# EAGLE design swimate_displayext (EAGLE 6.4)
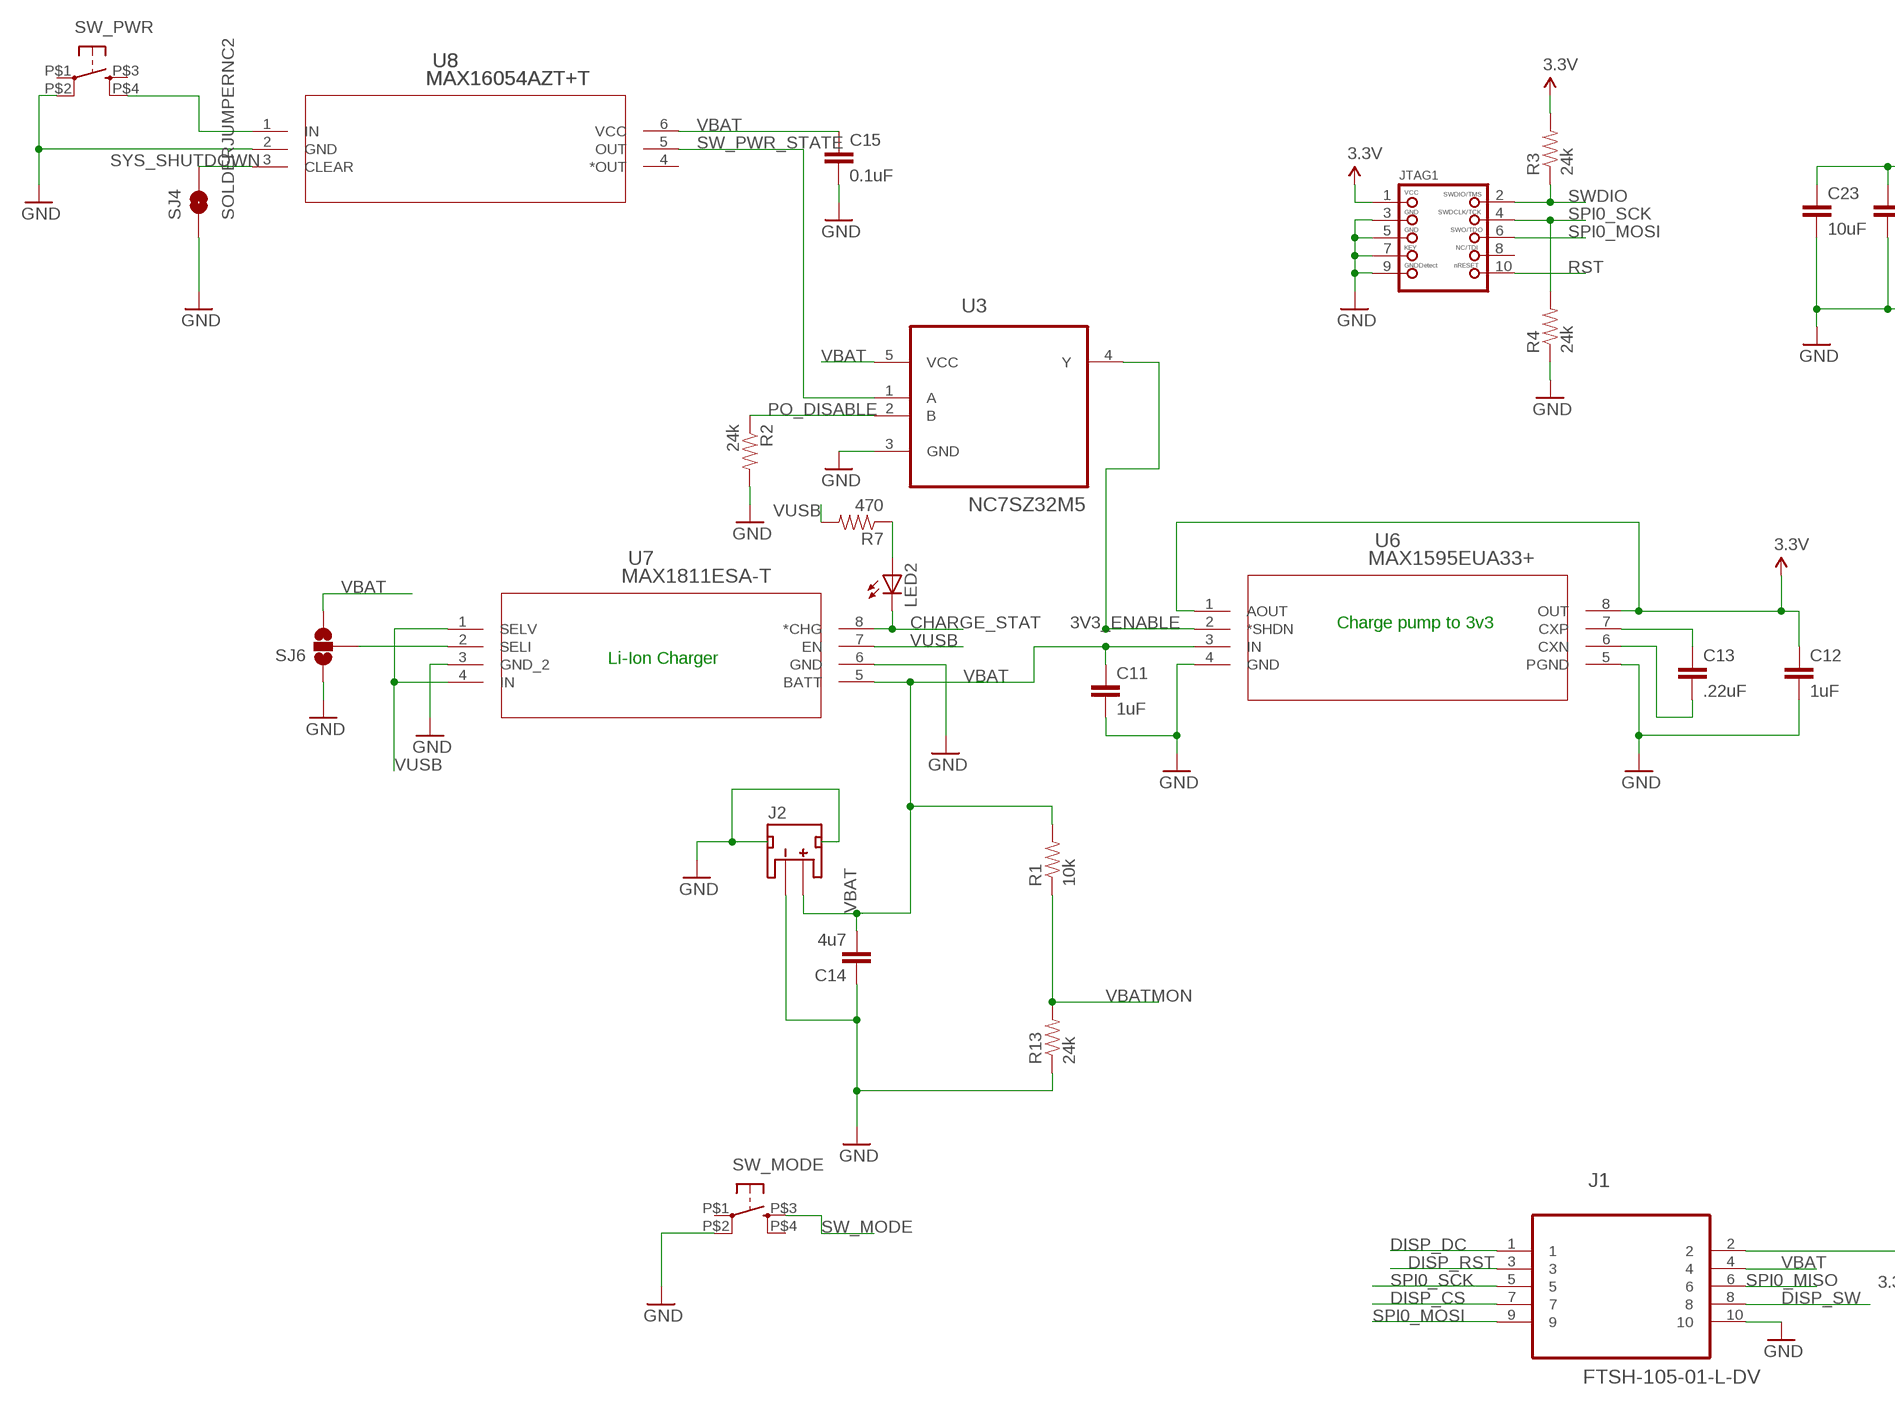
[diagram p0: schematic, sheet 1, part 1 of 2]
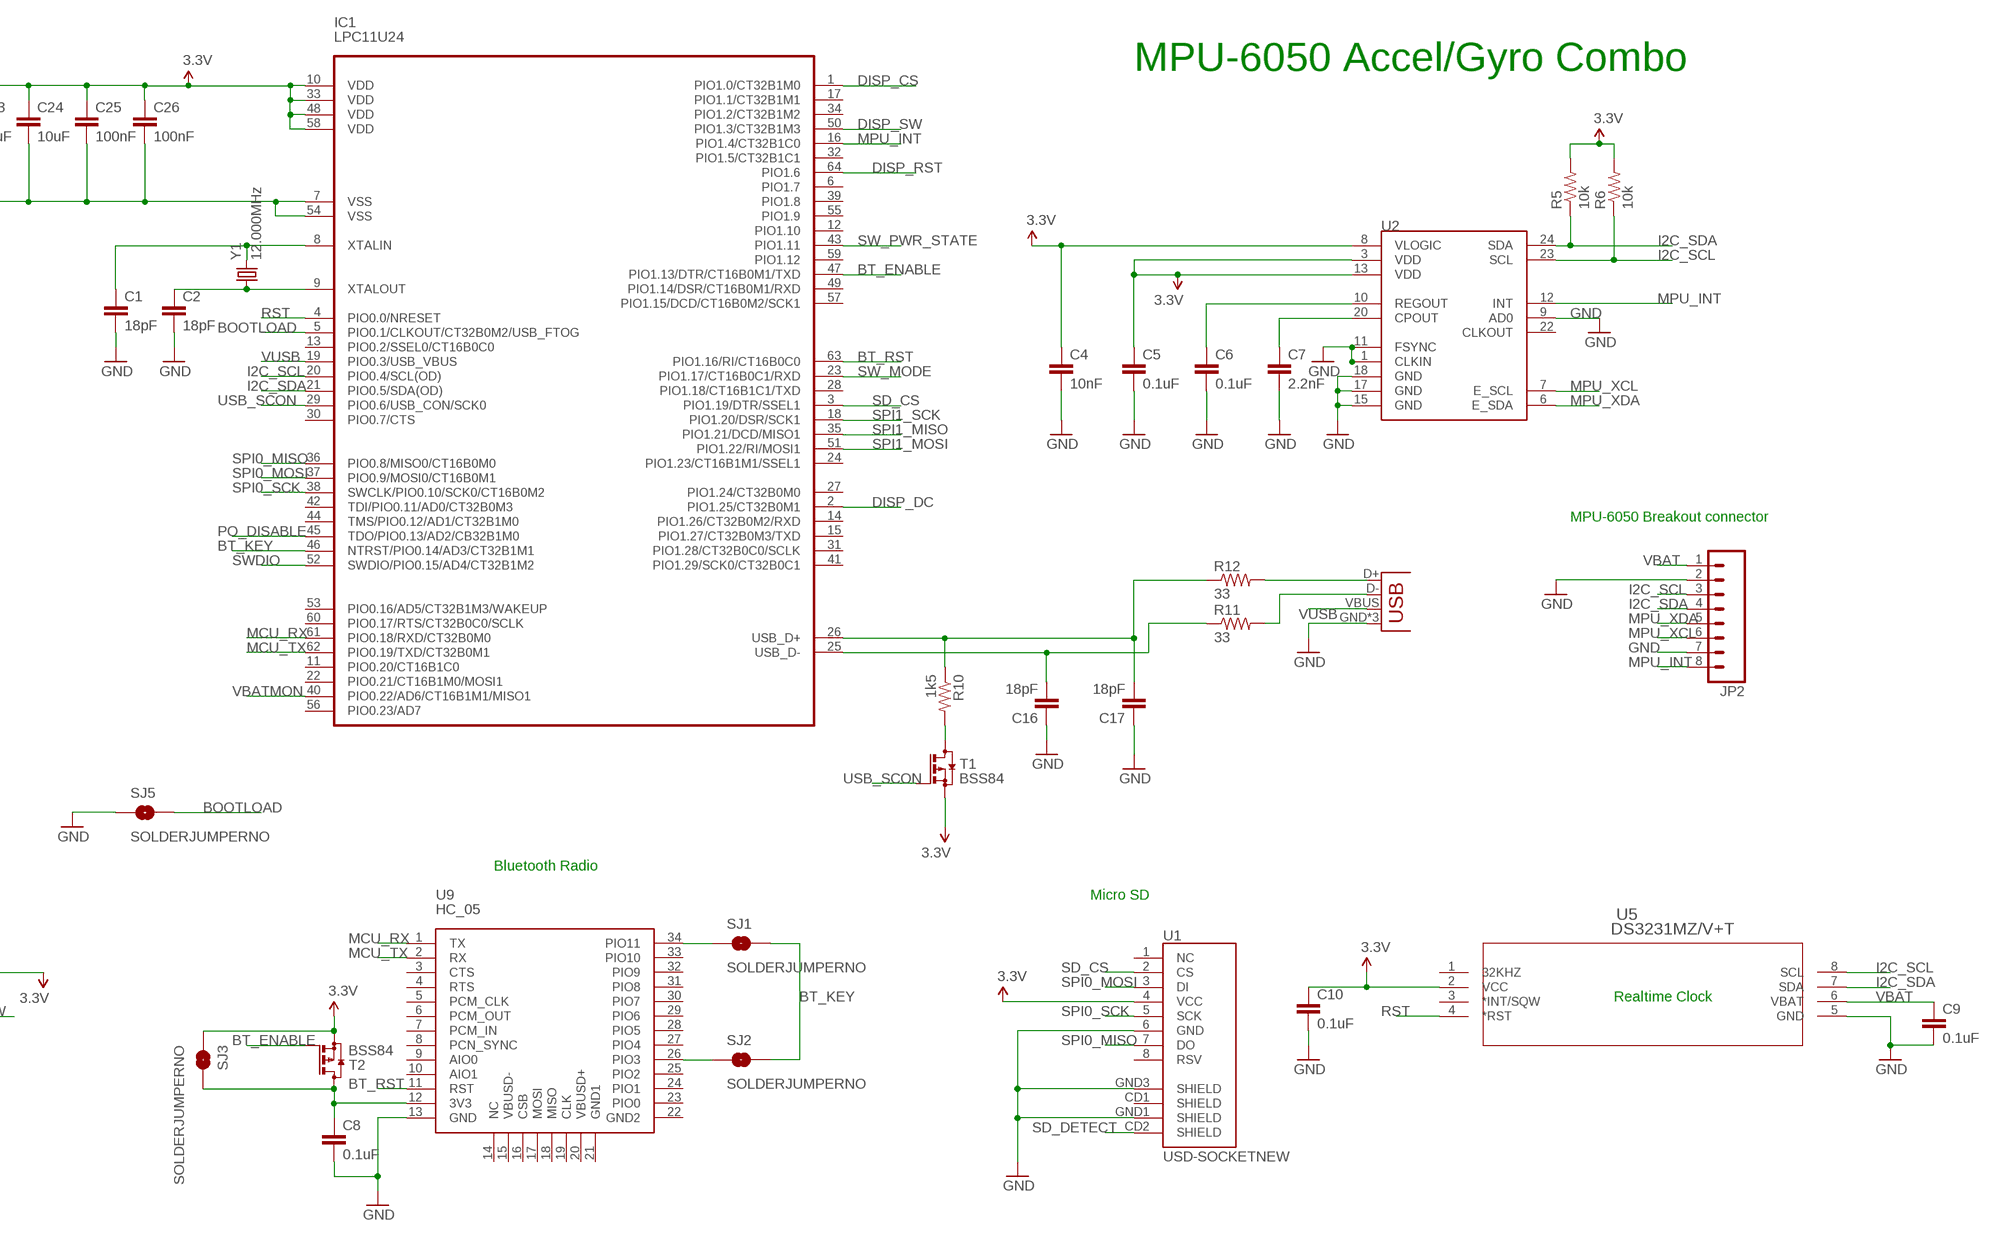
[diagram p1: schematic, sheet 1, part 2 of 2]

## Parts
C1  18pF  CAP0805  [0805]
C2  18pF  CAP0805  [0805]
C4  10nF  CAP0805  [0805]
C5  0.1uF  CAP0805  [0805]
C6  0.1uF  CAP0805  [0805]
C7  2.2nF  CAP0805  [0805]
C8  0.1uF  CAP0805  [0805]
C9  0.1uF  CAP0805  [0805]
C10  0.1uF  CAP0805  [0805]
C11  1uF  CAP1206  [1206]
C12  1uF  CAP1206  [1206]
C13  .22uF  CAP0805  [0805]
C14  4u7  CAP1206  [1206]
C15  0.1uF  CAP0805  [0805]
C16  18pF  CAP0805  [0805]
C17  18pF  CAP0805  [0805]
C23  10uF  CAP0805  [0805]
C24  10uF  CAP0805  [0805]
C25  100nF  CAP0805  [0805]
C26  100nF  CAP0805  [0805]
IC1  LPC11U24  [MBED-ICS_LQFP64]
J1  FTSH-105-01-L-DV  [SAMTEC_FTSH-105-01-L-DV]
J2  JST_2MM_MALE  [JST-2-SMD]
JP2  M08  [1X08_PIN1_NO_SILK]
JP3  USB-MICROB  [USB-MICROB]
JTAG1  JTAG-CORTEXM3  [2X05_1.27MM_SMT]
LED2  LED0603  [LED-0603]
R1  10k  RESISTOR0603-RES  [0603-RES]
R2  24k  RESISTOR0805-RES  [0805]
R3  24k  RESISTOR0805-RES  [0805]
R4  24k  RESISTOR0805-RES  [0805]
R5  10k  RESISTOR0805-RES  [0805]
R6  10k  RESISTOR0805-RES  [0805]
R7  470  RESISTOR0805-RES  [0805]
R10  1k5  RESISTOR0805-RES  [0805]
R11  33  RESISTOR0805-RES  [0805]
R12  33  RESISTOR0805-RES  [0805]
R13  24k  RESISTOR0603-RES  [0603-RES]
SJ1  SOLDERJUMPERNO  [SJ_2S-NO]
SJ2  SOLDERJUMPERNO  [SJ_2S-NO]
SJ3  SOLDERJUMPERNO  [SJ_2S-NO]
SJ4  SOLDERJUMPERNC2  [SJ_2S-NOTRACE]
SJ5  SOLDERJUMPERNO  [SJ_2S-NO]
SJ6  SOLDERJUMPER_2WAYS  [SJ_3]
SW_MODE  TAC_SWITCHKSA_SEALED  [KSA_SEALED_TAC_SWITCH]
SW_PWR  TAC_SWITCHKSA_SEALED  [KSA_SEALED_TAC_SWITCH]
T1  BSS84  [SOT23]
T2  BSS84  [SOT23]
U1  USD-SOCKETNEW  [MICRO-SD-SOCKET-PP]
U2  MPU-9150QFN-24-NP  [QFN-24-NP]
U3  NC7SZ32M5  [SOT95P280X145-5N]
U5  DS3231MZ/V+T  [21-0041B_8]
U6  MAX1595EUA33+  [21-0036K]
U7  MAX1811ESA-T  [21-0041B_8]
U8  MAX16054AZT+T  [21-0114C]
U9  HC_05  [BLUETOOTH_SMD]
Y1  12.000MHz  CRYSTAL10.5X4.8  [CRYSTAL-SMD-10.5X4.8-2PIN]

## Nets
3.3V: C4.1 C5.1 C10.1 C12.1 C23.1 C24.1 C25.1 C26.1 IC1.10(VDD) IC1.33(VDD) IC1.48(VDD) IC1.58(VDD) J1.2 JTAG1.1 R3.2 R5.2 R6.2 SJ3.1 T1.2(S) T2.2(S) U1.4(VCC) U2.3(VDD) U2.8(VLOGIC) U2.13(VDD) U5.2(VCC) U6.1(AOUT) U6.8(OUT)
3V3_ENABLE: U3.4(Y) U6.2(*SHDN)
BOOTLOAD: IC1.5(PIO0.1/CLKOUT/CT32B0M2/USB_FTOG) SJ5.2
BT_ENABLE: IC1.47(PIO1.13/DTR/CT16B0M1/TXD) T2.1(G)
BT_KEY: IC1.46(NTRST/PIO0.14/AD3/CT32B1M1) SJ1.2 SJ2.2
BT_RST: IC1.63(PIO1.16/RI/CT16B0C0) U9.11(RST)
CHARGE_STAT: LED2.C U7.8(*CHG)
DISP_CS: IC1.1(PIO1.0/CT32B1M0) J1.7
DISP_DC: IC1.2(PIO1.25/CT32B0M1) J1.1
DISP_RST: IC1.64(PIO1.6) J1.3
DISP_SW: IC1.50(PIO1.3/CT32B1M3) J1.8
GND: C1.2 C2.2 C4.2 C5.2 C6.2 C7.2 C8.2 C9.2 C10.2 C11.2 C12.2 C14.1 C15.2 C16.1 C17.1 C23.2 C24.2 C25.2 C26.2 IC1.7(VSS) IC1.54(VSS) J1.10 J2.1(-) J2.NC1(PAD1) J2.NC2(PAD2) JP2.2 JP2.7 JP3.GND JP3.MT1(GND) JP3.MT2(GND) JTAG1.3 JTAG1.5 JTAG1.7 JTAG1.9 R2.2 R4.1 R13.1 SJ4.1 SJ5.1 SJ6.1 SW_MODE.P$2 SW_PWR.P$2 U1.6(GND) U1.GND1(SHIELD) U1.GND3(SHIELD) U2.1(CLKIN) U2.9(AD0) U2.11(FSYNC) U2.15(GND) U2.17(GND) U2.18(GND) U3.3(GND) U5.5(GND) U6.4(GND) U6.5(PGND) U7.3(GND_2) U7.6(GND) U8.2(GND) U9.13(GND)
I2C_SCL: IC1.20(PIO0.4/SCL(OD)) JP2.3 R6.1 U2.23(SCL) U5.8(SCL)
I2C_SDA: IC1.21(PIO0.5/SDA(OD)) JP2.4 R5.1 U2.24(SDA) U5.7(SDA)
MCU_RX: IC1.61(PIO0.18/RXD/CT32B0M0) U9.1(TX)
MCU_TX: IC1.62(PIO0.19/TXD/CT32B0M1) U9.2(RX)
MPU_INT: IC1.16(PIO1.4/CT32B1C0) JP2.8 U2.12(INT)
MPU_XCL: JP2.6 U2.7(E_SCL)
MPU_XDA: JP2.5 U2.6(E_SDA)
N$1: SW_PWR.P$4 U8.1(IN)
N$3: SJ6.2 U7.2(SELI)
N$5: C6.1 U2.10(REGOUT)
N$7: C7.1 U2.20(CPOUT)
N$8: LED2.A R7.1
N$9: SJ2.1 U9.26(PIO3)
N$11: SJ1.1 U9.34(PIO11)
N$13: C13.1 U6.7(CXP)
N$14: C13.2 U6.6(CXN)
N$15: C8.1 SJ3.2 T2.3(D) U9.12(3V3)
N$16: R10.2 T1.3(D)
N$19: JP3.D+ R12.2
N$20: JP3.D- R11.2
N$23: C1.1 IC1.8(XTALIN) Y1.P$2
N$24: C2.1 IC1.9(XTALOUT) Y1.P$1
PO_DISABLE: IC1.45(TDO/PIO0.13/AD2/CB32B1M0) R2.1 U3.2(B)
RST: IC1.4(PIO0.0/NRESET) JTAG1.10 U5.4(*RST)
SD_CS: IC1.3(PIO1.19/DTR/SSEL1) U1.2(CS)
SD_DETECT: U1.CD2(SHIELD)
SPI0_MISO: IC1.36(PIO0.8/MISO0/CT16B0M0) J1.6 U1.7(DO)
SPI0_MOSI: IC1.37(PIO0.9/MOSI0/CT16B0M1) J1.9 JTAG1.6 U1.3(DI)
SPI0_SCK: IC1.38(SWCLK/PIO0.10/SCK0/CT16B0M2) J1.5 JTAG1.4 R4.2 U1.5(SCK)
SPI1_MISO: IC1.35(PIO1.21/DCD/MISO1)
SPI1_MOSI: IC1.51(PIO1.22/RI/MOSI1)
SPI1_SCK: IC1.18(PIO1.20/DSR/SCK1)
SW_MODE: IC1.23(PIO1.17/CT16B0C1/RXD) SW_MODE.P$3
SW_PWR_STATE: IC1.43(PIO1.11) U3.1(A) U8.5(OUT)
SWDIO: IC1.52(SWDIO/PIO0.15/AD4/CT32B1M2) JTAG1.2 R3.1
SYS_SHUTDOWN: SJ4.2 U8.3(CLEAR)
USB_SCON: IC1.29(PIO0.6/USB_CON/SCK0) T1.1(G)
USBD_N: C16.2 IC1.25(USB_D-) R11.1
USBD_P: C17.2 IC1.26(USB_D+) R10.1 R12.1
VBAT: C9.1 C11.1 C14.2 C15.1 J1.4 J2.2(+) JP2.1 R1.2 SJ6.3 U3.5(VCC) U5.6(VBAT) U6.3(IN) U7.5(BATT) U8.6(VCC)
VBATMON: IC1.40(PIO0.22/AD6/CT16B1M1/MISO1) R1.1 R13.2
VUSB: IC1.19(PIO0.3/USB_VBUS) JP3.VBUS R7.2 U7.1(SELV) U7.4(IN) U7.7(EN)
Unconnected: IC1.6(PIO1.7) IC1.11(PIO0.20/CT16B1C0) IC1.12(PIO1.10) IC1.13(PIO0.2/SSEL0/CT16B0C0) IC1.14(PIO1.26/CT32B0M2/RXD) IC1.15(PIO1.27/CT32B0M3/TXD) IC1.17(PIO1.1/CT32B1M1) IC1.22(PIO0.21/CT16B1M0/MOSI1) IC1.24(PIO1.23/CT16B1M1/SSEL1) IC1.27(PIO1.24/CT32B0M0) IC1.28(PIO1.18/CT16B1C1/TXD) IC1.30(PIO0.7/CTS) IC1.31(PIO1.28/CT32B0C0/SCLK) IC1.32(PIO1.5/CT32B1C1) IC1.34(PIO1.2/CT32B1M2) IC1.39(PIO1.8) IC1.41(PIO1.29/SCK0/CT32B0C1) IC1.42(TDI/PIO0.11/AD0/CT32B0M3) IC1.44(TMS/PIO0.12/AD1/CT32B1M0) IC1.49(PIO1.14/DSR/CT16B0M1/RXD) IC1.53(PIO0.16/AD5/CT32B1M3/WAKEUP) IC1.55(PIO1.9) IC1.56(PIO0.23/AD7) IC1.57(PIO1.15/DCD/CT16B0M2/SCK1) IC1.59(PIO1.12) IC1.60(PIO0.17/RTS/CT32B0C0/SCLK) JTAG1.8 SW_MODE.P$1 SW_MODE.P$4 SW_PWR.P$1 SW_PWR.P$3 U1.1(NC) U1.8(RSV) U1.CD1(SHIELD) U2.22(CLKOUT) U5.1(32KHZ) U5.3(*INT/SQW) U8.4(*OUT) U9.3(CTS) U9.4(RTS) U9.5(PCM_CLK) U9.6(PCM_OUT) U9.7(PCM_IN) U9.8(PCN_SYNC) U9.9(AIO0) U9.10(AIO1) U9.14(NC) U9.15(VBUSD-) U9.16(CSB) U9.17(MOSI) U9.18(MISO) U9.19(CLK) U9.20(VBUSD+) U9.21(GND1) U9.22(GND2) U9.23(PIO0) U9.24(PIO1) U9.25(PIO2) U9.27(PIO4) U9.28(PIO5) U9.29(PIO6) U9.30(PIO7) U9.31(PIO8) U9.32(PIO9) U9.33(PIO10)

## Notes on the sheet
- MPU-6050 Accel/Gyro Combo
- Charge pump to 3v3
- Li-Ion Charger
- MPU-6050 Breakout connector
- Bluetooth Radio
- Micro SD
- Realtime Clock

## Library data of the parts
C1 C2 C4-C10 C13-C17 = SparkFun-Passives:CAP: Capacitor Standard 0603 ceramic capacitor, and 0.1" leaded capacitor.
C11 C12 C23-C26 = SparkFun-Capacitors:CAP: Capacitor Standard 0603 ceramic capacitor, and 0.1" leaded capacitor.
IC1 = mbed-HDK:LPC11U24: NXP Cortex-M0 Micrcontroller
J1 = SAMTEC-HTSW-FTxx_By_element14_Batch_1:FTSH-105-01-L-DV: CONN HEADER, 1.27MM, 2X5WAY, SMT; MPN: FTSH-105-01-L-DV; OC_FARNELL: 1667759; OC_NEWARK: 11P4814; PACKAGE: HEADER, 1.27MM, 2X5WAY, SMT; SUPPLIER: SAMTEC
J2 = SparkFun-Connectors:JST_2MM_MALE: Mates to single-cell LiPo batteries. CONN-08352; PROD_ID: CONN-08352
JP2 = SparkFun-Connectors:M08: Header 8 Standard 8-pin 0.1" header. Use with straight break away headers (SKU : PRT-00116), right angle break away headers (PRT-00553), swiss pins (PRT-00743), machine pins (PRT-00117), and female headers (PRT-00115).
JP3 = SparkFun-Connectors:USB: USB Connectors USB-B-PTH is fully proven SKU : PRT-00139/CONN-08278 USB-miniB is fully proven SKU : PRT-00587 USB-A-PCB is untested. USB-A-H is throughly reviewed, but untested. Spark Fun Electronics SKU : PRT-00437 USB-B-SMT is throughly reviewed, but untested. Needs silkscreen touching up. USB-A-S has not been used/tested USB-MB-H has not been used/tested USB-MICROB has been used. CONN-09505; PROD_ID: CONN-09505
JTAG1 = microbuilder:JTAG-CORTEXM3: Serial Wire (SW-DP) Connector This standard 0.05" 10-pin connector is for use with the Cortex M0/M3's native SWD (serial wire debugger) interface (SW-DP). Some boards support a 20-pin combined JTAG+SWD connector (SWJ-DP), such as the LPC1700 family, but many smaller devices only work with SWD which typically use the smaller 10-pin SW-DP connecter (the LPC1300 family, for example, only supports SWD). 2x05 1.27mm/0.05" Connector: This is the standard SMT connector defined by ARM for all Cortex devices, and should be used in most situations and for forward-compatibility since any new devices coming to market will likely use this connector. MOLEX 10 Pin 0.1" Connector: This 0.1" 10 pin connector has the same pin layout as the standard 0.05" connector, but is easier to work with if you are using standard jumper wires or custom cables to connect your SWD hardware. MOLEX 20 Pin 0.1" Connector: This 0.1" 20 pin connector is the same model used for ARM7/ARM9 JTAG debuggers, but is connected to match the pins on the Segger J-Link for ARM (which supports both JTAG and SWD debugging). See the following document from ARM for more information on Cortex M3 Debug Connectors: http://infocenter.arm.com/help/topic/com.arm.doc.faqs/attached/13634/cortex_debug_connectors.pdf And the following page for an overview with images of the different connector types: http://www.keil.com/peripherals/coresight/connectors.asp
LED2 = SparkFun-LED:LED: LEDs Standard schematic elements and footprints for 5mm, 3mm, 1206, and 0603 sized LEDs. 5mm - Spark Fun Electronics SKU : COM-00529 (and others)
R1-R7 R10-R13 = SparkFun-Passives:RESISTOR: Resistor Basic schematic elements and footprints for 0603, 1206, and PTH resistors.
SJ1-SJ5 = SparkFun-Passives:SOLDERJUMPER: Solder Jumper Standard SMD solder jumper. Used to automate production. Two varients : Normally Open and Normally Closed are the same, but have different paste layers. NC will have a large amount of paste and should jumper during reflow.
SJ6 = SparkFun-Passives:SOLDERJUMPER_2WAY: Solder Jumper 2 way solder jumper
SW_MODE SW_PWR = SparkFun-Electromechanical:TAC_SWITCH: Momentary Switch Button commonly used for reset or general input. Spark Fun Electronics SKU : COM-00097 SMT- SWCH-08247
T1 T2 = mbed-HDK:BSS84: P-CHANNEL MOS FET
U1 = SparkFun-Connectors:USD-SOCKET: microSD Socket Push-push type uSD socket. Schematic element and footprint production proven. Spark Fun Electronics SKU : PRT-00127. tDoc lines correctly indicate media card edge positions when inserting (unlocked, locked, depressed).
U2 = SparkFun-Sensors:MPU-9150: 9DOF (3mag, 3accel, 3rotat). I2C interface.
U3 = Fairchild_By_element14_Batch_1:NC7SZ32M5: Tiny logic UHS Two-Input OR Gate; MPN: NC7SZ32M5; OC_FARNELL: 1013810; OC_NEWARK: 34C1570; PACKAGE: SOT-23-5; SUPPLIER: Fairchild
U5 = maximparts:DS3231MZ/V+T; MANUFACTURER_NAME: Maxim; MANUFACTURER_PART_NUMBER: DS3231MZ/V+T; VENDOR: Maxim
U6 = maximparts:MAX1595EUA33+; MANUFACTURER_NAME: Maxim; MANUFACTURER_PART_NUMBER: MAX1595EUA33+; VENDOR: Maxim
U7 = maximparts:MAX1811ESA-T; MANUFACTURER_NAME: Maxim; MANUFACTURER_PART_NUMBER: MAX1811ESA-T; VENDOR: Maxim
U8 = maximparts:MAX16054AZT+T; MANUFACTURER_NAME: Maxim; MANUFACTURER_PART_NUMBER: MAX16054AZT+T; VENDOR: Maxim
U9 = Bluetooth HC-05:HC_05: HC-05 Bluetooth Module
Y1 = SparkFun-FreqCtrl:CRYSTAL: Various standard crystals. Proven footprints. Spark Fun Electronics SKU : COM-00534

## Board
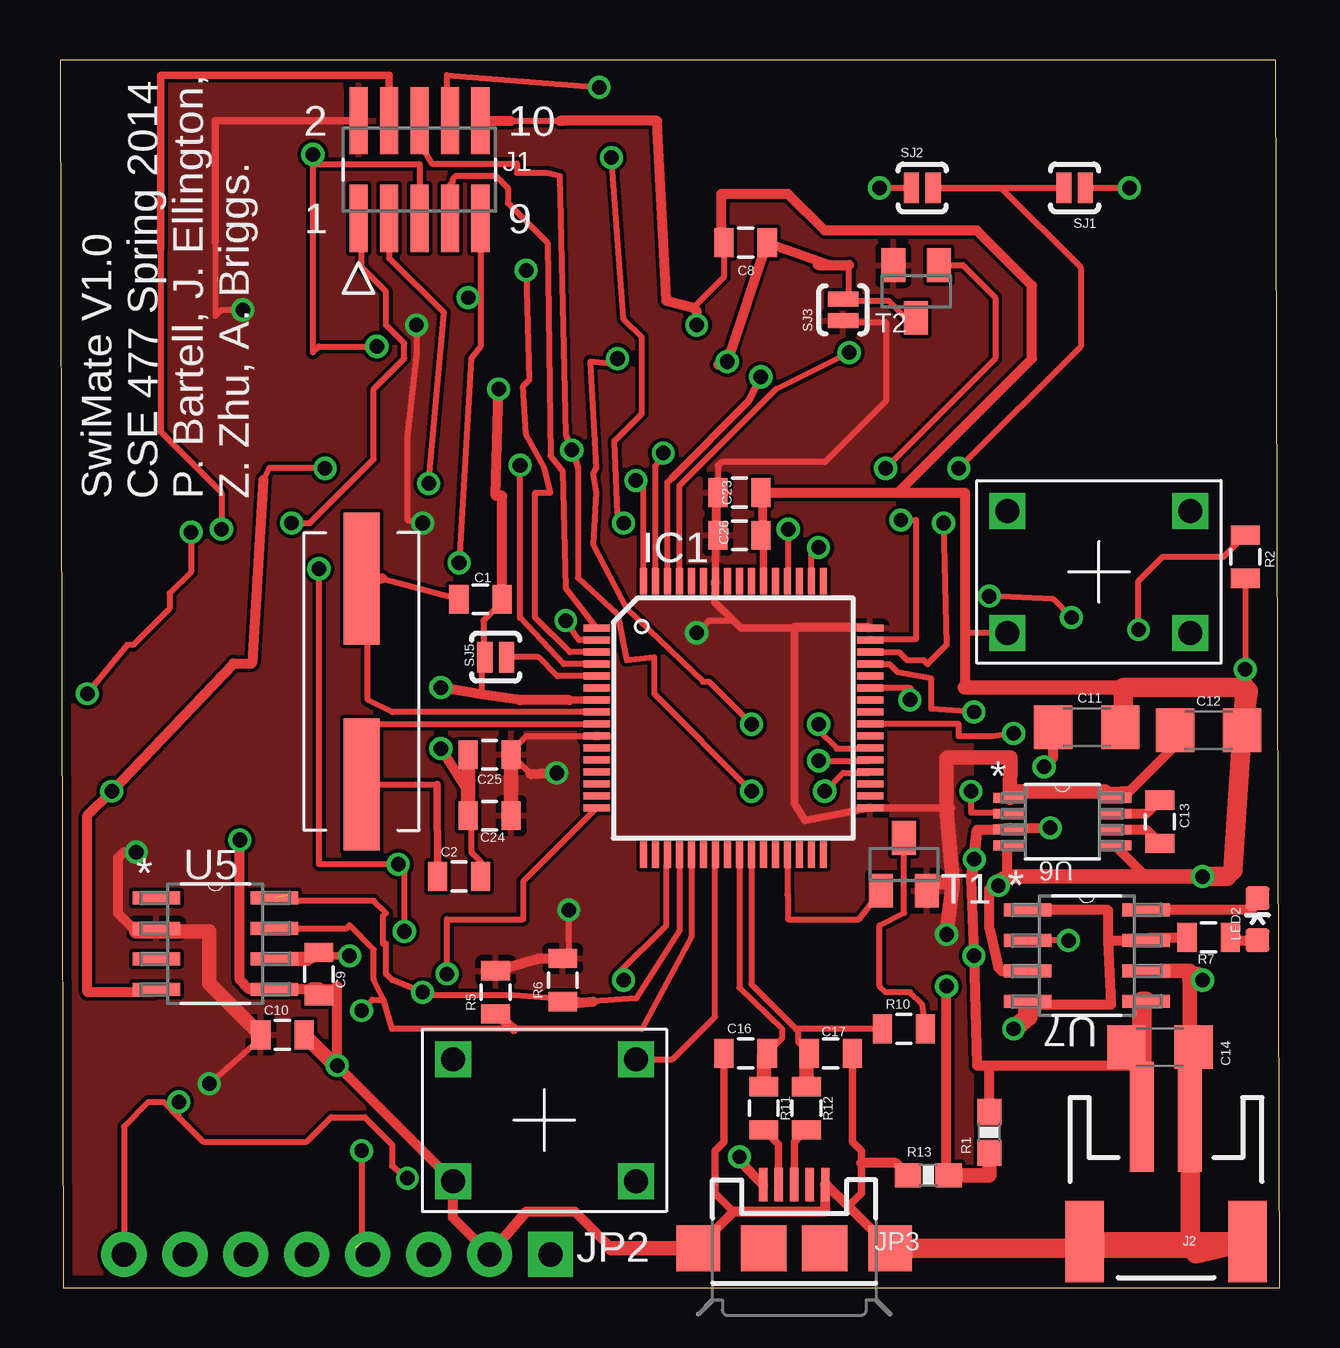
[diagram p2: board, top side]
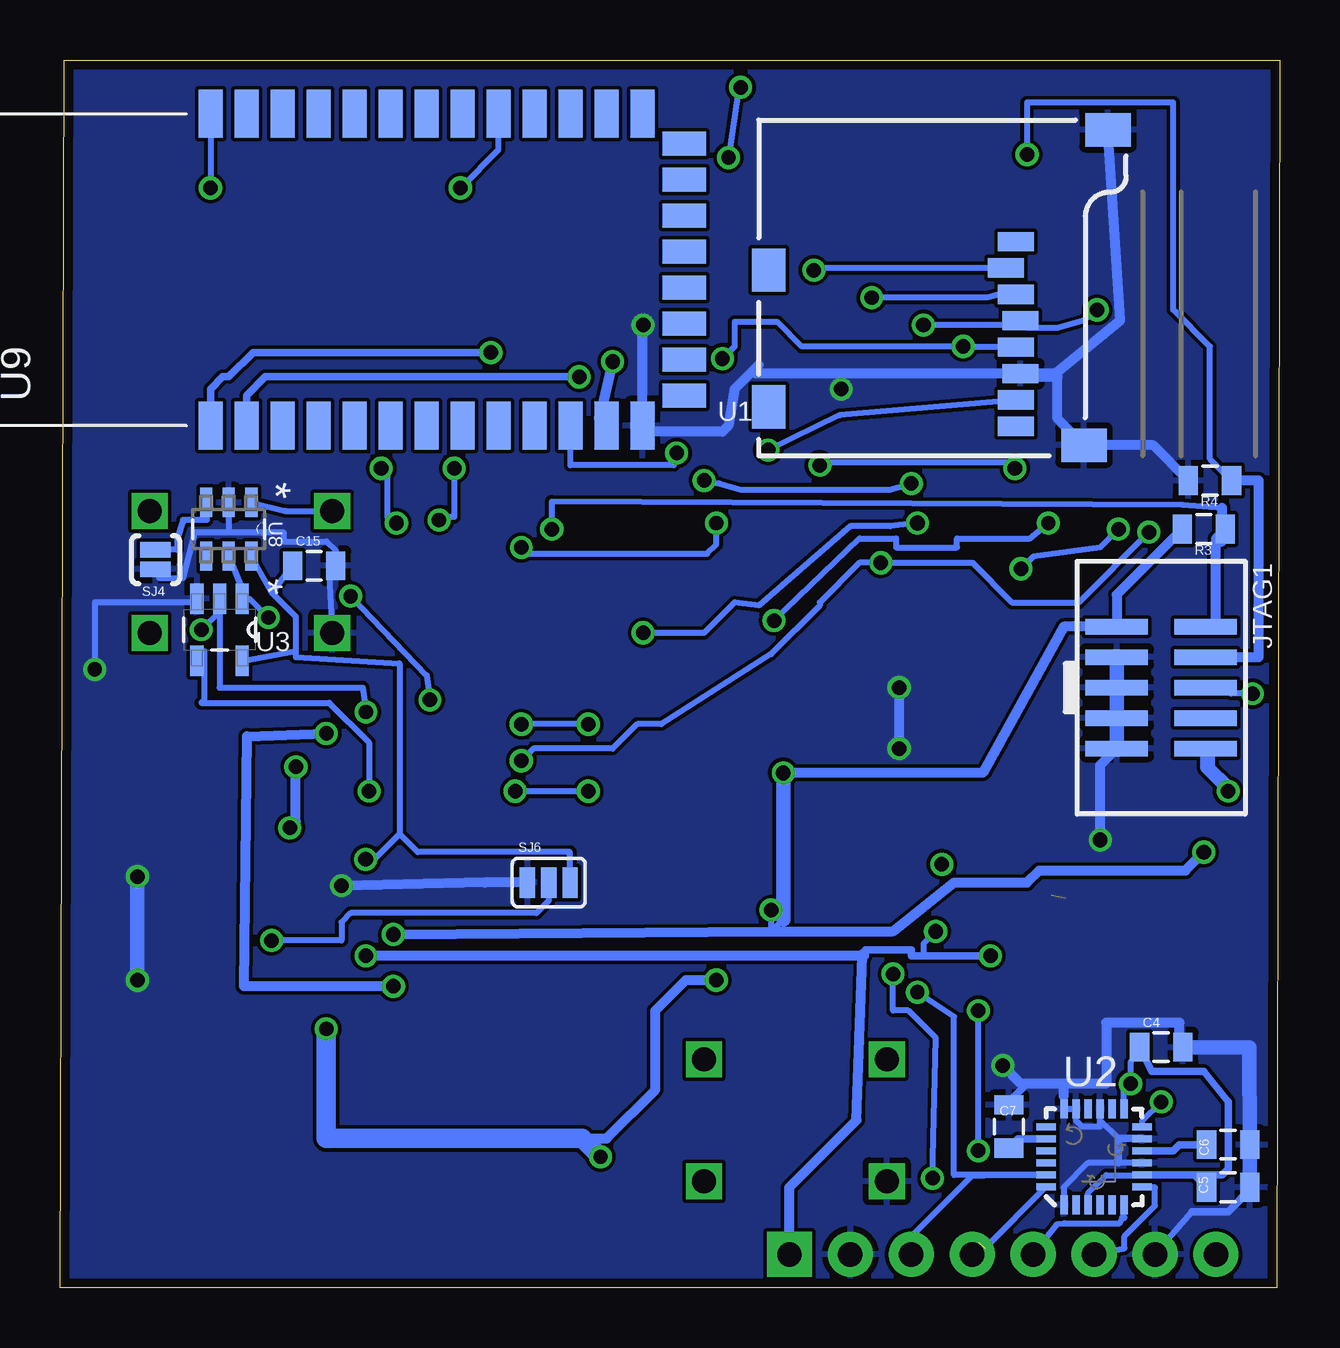
[diagram p3: board, bottom side, seen from below]

Size 50.85 x 51.18 mm. Coordinates in mm from the lower left corner, seen from the top.
Outline: 0.13,0 50.85,0 50.67,51.18 0,51.17 0.13,0
Copper layers (1*16): Top 0.0356mm / dielectric 1.5011mm / Bottom 0.0356mm
Design rules "LaenPCBOrder": minimum track width 6mil, minimum drill 13mil, track to track 6mil, track to pad 6mil, pad to pad 6mil, via to via 6mil, smd to smd 6mil, copper to edge 15mil, drill to drill 6mil, minimum pad ring 7mil, minimum via ring 7mil, stop-mask expansion 3mil, vias tented up to drill 0mil, thermal gap 10mil

### Footprints (pad centres in the part's own frame; a part is rotated, then mirrored left to right if it is on the bottom)
0805 = smd 0.8 x 1.2: 1 -0.9,0; 2 0.9,0
1206 = smd 1.6 x 1.8: 1 -1.4,0; 2 1.4,0
MBED-ICS_LQFP64 = smd 1.1 x 0.285: 1 -5.7,3.75; 2 -5.7,3.25; 3 -5.7,2.75; 4 -5.7,2.25; 5 -5.7,1.75; 6 -5.7,1.25; 7 -5.7,0.75; 8 -5.7,0.25; 9 -5.7,-0.25; 10 -5.7,-0.75; 11 -5.7,-1.25; 12 -5.7,-1.75; 13 -5.7,-2.25; 14 -5.7,-2.75; 15 -5.7,-3.25; 16 -5.7,-3.75; 33 5.7,-3.75; 34 5.7,-3.25; 35 5.7,-2.75; 36 5.7,-2.25; 37 5.7,-1.75; 38 5.7,-1.25; 39 5.7,-0.75; 40 5.7,-0.25; 41 5.7,0.25; 42 5.7,0.75; 43 5.7,1.25; 44 5.7,1.75; 45 5.7,2.25; 46 5.7,2.75; 47 5.7,3.25; 48 5.7,3.75 | smd 0.285 x 1.1: 17 -3.75,-5.7; 18 -3.25,-5.7; 19 -2.75,-5.7; 20 -2.25,-5.7; 21 -1.75,-5.7; 22 -1.25,-5.7; 23 -0.75,-5.7; 24 -0.25,-5.7; 25 0.25,-5.7; 26 0.75,-5.7; 27 1.25,-5.7; 28 1.75,-5.7; 29 2.25,-5.7; 30 2.75,-5.7; 31 3.25,-5.7; 32 3.75,-5.7; 49 3.75,5.7; 50 3.25,5.7; 51 2.75,5.7; 52 2.25,5.7; 53 1.75,5.7; 54 1.25,5.7; 55 0.75,5.7; 56 0.25,5.7; 57 -0.25,5.7; 58 -0.75,5.7; 59 -1.25,5.7; 60 -1.75,5.7; 61 -2.25,5.7; 62 -2.75,5.7; 63 -3.25,5.7; 64 -3.75,5.7
SAMTEC_FTSH-105-01-L-DV = smd 0.762 x 2.794: 1 -2.54,-2.032; 2 -2.54,2.032; 3 -1.27,-2.032; 4 -1.27,2.032; 5 0,-2.032; 6 0,2.032; 7 1.27,-2.032; 8 1.27,2.032; 9 2.54,-2.032; 10 2.54,2.032
JST-2-SMD = smd 1 x 4.6: 1 -1,-3.7; 2 1,-3.7 | smd 1.6 x 3.4: NC1 -3.4,1.5; NC2 3.4,1.5
1X08_PIN1_NO_SILK = drill 1.016 pad 1.88 square: 1 0,0 | drill 1.016 pad 1.88: 2 2.54,0; 3 5.08,0; 4 7.62,0; 5 10.16,0; 6 12.7,0; 7 15.24,0; 8 17.78,0
USB-MICROB = smd 0.35 x 1.4: D+ 0,2.65; D- -0.65,2.65; GND 1.3,2.65; ID 0.65,2.65; VBUS -1.3,2.65 | smd 1.8 x 1.9: MT1 -4,0; MT2 4,0 | smd 1.9 x 1.9: P$1 -1.27,0; P$2 1.27,0
2X05_1.27MM_SMT = smd 0.65 x 2.6: 1 -2.54,-1.85; 2 -2.54,1.85; 3 -1.27,-1.85; 4 -1.27,1.85; 5 0,-1.85; 6 0,1.85; 7 1.27,-1.85; 8 1.27,1.85; 9 2.54,-1.85; 10 2.54,1.85
LED-0603 = smd 1 x 1: A 0,-0.877; C 0,0.877
0603-RES = smd 1.1 x 1: 1 -0.85,0; 2 0.85,0
SJ_2S-NO = smd 0.635 x 1.27: 1 -0.45,0; 2 0.45,0
SJ_2S-NOTRACE = smd 0.635 x 1.27: 1 -0.401,0; 2 0.413,0
SJ_3 = smd 0.635 x 1.27: 1 -0.889,0; 2 0,0; 3 0.889,0
KSA_SEALED_TAC_SWITCH = drill 1 square: P$1 -3.81,2.54; P$2 3.81,2.54; P$3 -3.81,-2.54; P$4 3.81,-2.54
SOT23 = smd 1 x 1.4: 1 -0.95,-1.1; 2 0.95,-1.1; 3 0,1.1
MICRO-SD-SOCKET-PP = smd 0.8 x 1.5: 1 -8.94,10.7; 2 -7.84,10.3; 3 -6.74,10.7; 4 -5.64,10.9; 5 -4.54,10.7; 6 -3.44,10.9; 7 -2.34,10.7; 8 -1.24,10.7 | smd 1.8 x 1.4: CD1 -2.05,0.4; CD2 -7.75,0.4 | smd 1.4 x 1.9: GND1 -13.6,14.55; GND3 -0.45,13.55
QFN-24-NP = smd 0.8 x 0.3: 1 -2,1.25; 2 -2,0.75; 3 -2,0.25; 4 -2,-0.25; 5 -2,-0.75; 6 -2,-1.25; 13 2,-1.25; 14 2,-0.75; 15 2,-0.25; 16 2,0.25; 17 2,0.75; 18 2,1.25 | smd 0.3 x 0.8: 7 -1.25,-2; 8 -0.75,-2; 9 -0.25,-2; 10 0.25,-2; 11 0.75,-2; 12 1.25,-2; 19 1.25,2; 20 0.75,2; 21 0.25,2; 22 -0.25,2; 23 -0.75,2; 24 -1.25,2
SOT95P280X145-5N = smd 1.27 x 0.559: 1 -1.295,0.94; 2 -1.295,0; 3 -1.295,-0.94; 4 1.295,-0.94; 5 1.295,0.94
21-0041B_8 = smd 1.981 x 0.533: 1 -2.464,1.905; 2 -2.464,0.635; 3 -2.464,-0.635; 4 -2.464,-1.905; 5 2.464,-1.905; 6 2.464,-0.635; 7 2.464,0.635; 8 2.464,1.905
21-0036K = smd 1.372 x 0.406: 1 -2.184,0.991; 2 -2.184,0.33; 3 -2.184,-0.33; 4 -2.184,-0.991; 5 2.184,-0.991; 6 2.184,-0.33; 7 2.184,0.33; 8 2.184,0.991
21-0114C = smd 1.219 x 0.508: 1 -1.118,0.94; 2 -1.118,0; 3 -1.118,-0.94; 4 1.118,-0.94; 5 1.118,0; 6 1.118,0.94
BLUETOOTH_SMD = smd 2 x 1: 1 -6.35,3.81; 2 -6.35,2.31; 3 -6.35,0.81; 4 -6.35,-0.69; 5 -6.35,-2.19; 6 -6.35,-3.69; 7 -6.35,-5.19; 8 -6.35,-6.69; 9 -6.35,-8.19; 10 -6.35,-9.69; 11 -6.35,-11.19; 12 -6.35,-12.69; 13 -6.35,-14.19; 22 6.65,-14.19; 23 6.65,-12.69; 24 6.65,-11.19; 25 6.65,-9.69; 26 6.65,-8.19; 27 6.65,-6.69; 28 6.65,-5.19; 29 6.65,-3.69; 30 6.65,-2.19; 31 6.65,-0.69; 32 6.65,0.81; 33 6.65,2.31; 34 6.65,3.81 | smd 1 x 1.8: 14 -5.1,-15.94; 15 -3.6,-15.94; 16 -2.1,-15.94; 17 -0.6,-15.94; 18 0.9,-15.94; 19 2.4,-15.94; 20 3.9,-15.94; 21 5.4,-15.94
CRYSTAL-SMD-10.5X4.8-2PIN = smd 5.5 x 1.5: P$1 -4.3,0; P$2 4.3,0

### Placement (x,y rotation side)
C1  17.53,28.7 0 top
C2  16.64,17.14 0 top
C4  4.95,10.03 0 bottom
C5  2.16,4.19 0 bottom
C6  2.16,5.97 0 bottom
C7  11.3,6.73 90 bottom
C8  28.57,43.56 180 top
C9  10.79,13.08 270 top
C10  9.27,10.54 0 top
C11  42.8,23.37 0 top
C12  47.88,23.24 0 top
C13  45.85,19.43 270 top
C14  45.85,10.03 180 top
C15  40.26,30.1 0 bottom
C16  28.57,9.78 0 top
C17  32.13,9.78 180 top
C23  28.32,33.15 0 top
C24  17.91,19.68 180 top
C25  17.91,22.23 180 top
C26  28.32,31.37 0 top
IC1  28.07,23.75 0 top
J1  14.99,46.61 0 top
J2  46.1,3.43 180 top
JP2  20.45,1.4 180 top
JP3  30.61,1.65 0 top
JTAG1  4.95,25.02 270 bottom
LED2  49.91,15.37 0 top
R1  38.73,6.48 90 top
R2  49.4,30.48 270 top
R3  3.17,31.62 180 bottom
R4  2.92,33.66 0 bottom
R5  18.16,12.32 90 top
R6  20.95,12.83 90 top
R7  47.88,14.61 180 top
R10  35.18,10.79 0 top
R11  29.34,7.49 270 top
R12  31.11,7.49 270 top
R13  36.2,4.7 0 top
SJ1  42.29,45.85 180 top
SJ2  35.94,45.85 0 top
SJ3  32.64,40.77 90 top
SJ4  46.86,30.35 90 bottom
SJ5  18.16,26.29 0 top
SJ6  30.48,16.89 0 bottom
SW_MODE  20.19,6.99 180 top
SW_PWR  43.31,29.84 180 top
T1  35.18,17.65 0 top
T2  35.69,41.53 180 top
U1  21.72,34.67 270 bottom
U2  7.75,5.46 90 bottom
U3  44.2,27.43 270 bottom
U5  6.48,14.35 0 top
U6  41.78,19.43 0 top
U7  42.8,13.84 0 top
U8  43.82,31.62 270 bottom
U9  40.77,42.29 90 bottom
Y1  12.57,25.27 90 top

### Tracks (layer width: path | path; a pad name or v marks a point on that pad's centre or on a via)
3.3V  (via drill 0.6, 0.61)
  Top 0.254: C26.1 C23.1 27.42,34.28 27.56,34.42 31.88,34.42 34.42,36.96 34.42,40.26 32.7,40.26 | IC1.10 22.36,22.99 19.43,22.99 18.81,22.36 C25.1 19.63,21.41 | v14.86,40.13 14.86,38.99 14.48,35.43 14.48,32 v15.11,31.88 | v26.54,27.3 27.05,27.81 28.07,27.81 | 6.48,43.59 6.48,40.51 6.73,40.77 v7.62,40.77 | C10.1 8.37,10.4 v6.22,8.51 | 21.21,13.84 v21.21,15.75
  Top 0.305: v3.17,18.16 2.67,18.16 | R5.2 19.68,13.59 20.7,13.84 21.21,13.84 | 36.96,19.94 37.15,20 IC1.33 31.05,19.49 30.61,20.19 30.61,27.56 33.71,27.56 IC1.48 28.38,27.5 28.07,27.81 27.3,28.57 27.3,29.44 IC1.58 27.32,33 C23.1 | J1.2 6.48,48.64 6.48,43.59
  Top 0.406: 6.22,14.86 U5.2 | U6.1 39.6,20.55 39.75,20.7 | 43.56,20.7 44.25,20.7 | 44.25,20.7 44.58,20.7 46.73,22.86 C12.1 | 44.25,20.7 U6.8 | 2.67,18.16 2.41,17.91 2.41,15.62 3.17,14.86 | R5.2 19.94,13.73 R6.2 | v20.7,21.46 19.63,21.41
  Top 0.61: C10.1 6.22,12.69 6.22,14.86 3.17,14.86 | 39.75,20.7 43.56,20.7 | U6.1 39.62,22.1 36.98,22.1 36.96,22.07 36.96,19.94 37.21,16.89 | 37.21,16.89 36.3,16.89 T1.2 | 37.21,16.89 v36.96,14.73 | C25.1 C24.1
  Bottom 0.254: U2.3 8,3.94 7.24,4.7 5.76,4.7 U2.8 | v14.86,40.13 10.74,40.13 U1.4 10.51,40.01 9.27,40.01 8.2,40.31 v7.62,40.77 | v15.11,31.88 16.26,31.75 17.91,31.75 21.72,28.45 22.73,28.57 24,27.3 v26.54,27.3 | C4.1 6.22,9.41 v6.22,8.51 6.5,8.49 U2.13 | v21.21,15.75 21.21,14.86 20.7,15.37
  Bottom 0.305: C5.1 3.58,4.71 | 3.58,4.71 U2.8 | C4.1 5.34,9.02 3.17,9.02 2.16,7.75 2.16,4.95 2.4,4.71 3.58,4.71
  Bottom 0.406: v36.96,14.73 21.21,14.86 16.13,14.86 13.59,16.89 10.54,16.89 10.03,17.4 3.94,17.4 v3.17,18.16 | R3.2 6.8,28.89 JTAG1.1 9.02,27.56 12.39,21.46 v20.7,21.46
  Bottom 0.61: 20.7,15.37 v20.7,21.46
  pour Top: 0.38,50.67 50.67,50.67 50.67,34.04 37.97,34.04 37.97,0.64 0.38,0.64
3V3_ENABLE  (via drill 0.6)
  Top 0.254: v37.97,20.7 37.97,19.81 39.6,19.81 U6.2
  Bottom 0.254: U3.4 44.83,26.54 44.83,24.51 44.96,24.38 39.62,24.38 37.97,22.73 v37.97,20.7
BOOTLOAD
  Top 0.254: IC1.5 20.73,25.5 19.94,26.29 SJ5.2
BT_ENABLE  (via drill 0.6, 0.61)
  Top 0.254: T2.1 37.64,42.63 38.99,41.27 38.99,38.73 v34.42,34.16 | IC1.47 33.77,27.05 35.69,27.05 35.69,32 v35.05,32
  Bottom 0.254: v34.42,34.16 34.42,32.13 35.05,32.13 v35.05,32
BT_KEY  (via drill 0.61)
  Top 0.254: SJ1.2 SJ2.2 39.24,45.85 42.55,42.55 42.55,39.24 v37.47,34.16 | v36.83,31.88 36.96,26.8 36.16,26 36,26.16 35.31,26.16 34.97,26.5 IC1.46
  Bottom 0.254: v37.47,34.16 37.21,33.91 37.21,32.13 v36.83,31.88
BT_RST  (via drill 0.6)
  Top 0.254: IC1.63 24.82,34.24 v25.15,34.8
  Bottom 0.254: v25.15,34.8 25.4,34.8 25.27,34.29 29.58,34.29 U9.11
CHARGE_STAT
  Top 0.406: LED2.C 49.67,15.75 U7.8
DISP_CS
  Top 0.254: J1.7 16.26,45.97 16.38,46.1 16.38,46.23 16.51,46.35 18.16,46.35 18.67,45.85 18.67,45.21 20.32,43.56 20.45,34.67 20.95,34.04 21.08,29.16 IC1.1
DISP_DC  (via drill 0.6)
  Top 0.254: IC1.2 21.64,27 v21.08,27.81 | v9.65,31.88 10.41,31.88 13.08,34.54 13.08,37.47 14.35,38.73 14.35,39.37 13.59,40.13 13.59,41.53 12.57,42.55 12.57,44.83 12.32,45.09 12.32,44.7 J1.1
  Bottom 0.254: v21.08,27.81 17.53,31.24 16,31.24 16,30.86 13.46,30.86 13.46,31.24 10.41,31.24 v9.65,31.88
DISP_RST  (via drill 0.6)
  Top 0.254: J1.3 13.72,42.93 16,40.64 v15.37,33.53 | IC1.64 24.32,33.59 24.2,33.59 v24,33.66
  Bottom 0.254: v15.37,33.53 16.26,33.27 22.48,33.27 23.37,33.53 v24,33.66
DISP_SW  (via drill 0.6)
  Top 0.254: IC1.50 31.32,30.55 v31.62,30.86 | v23.49,31.88 23.24,32.26 23.11,35.31 24.26,36.45 24.26,39.62 23.49,40.39 v22.99,47.12 | J1.8 16.13,48.77 16.13,50.55 v22.48,50.04
  Bottom 0.254: v31.62,30.86 31.37,30.61 23.88,30.61 23.49,30.99 v23.49,31.88 | v22.48,50.04 22.61,49.66 v22.99,47.12
GND  (via drill 0.6, 0.61)
  Top 0.254: C14.1 46.86,13.21 | C23.2 C26.2 | 17.57,24.73 17.57,26.15 SJ5.1 17.65,26.35 17.65,27.81 18.55,28.71 C1.2 | C24.2 17.14,19.55 17.14,18.16 17.54,17.77 C2.2 | SW_PWR.P$2 37.72,27.3 | 49.39,24.88 49.4,24.88 v49.4,25.78 R2.2 | 18.79,48.64 20.95,48.65 | C8.2 27.67,42.12 26.4,40.85
  Top 0.305: C16.1 27.67,6.08 27.3,5.71 27.3,3.94 28.07,3.17 | C17.1 33.03,6.08 33.4,5.71 33.4,5.21 33.4,3.94 32.86,3.4 | C23.2 29.32,32.8 IC1.54 | 21.21,24.51 21.22,24.5 IC1.7
  Top 0.406: JP3.MT2 32.86,3.4 31.96,4.3 JP3.GND 31.88,4.3 31.88,3.17 28.07,3.17 27.05,2.16 27.05,2.09 JP3.MT1 | 22.99,1.65 21.46,3.17 19.43,3.17 JP2.2 16.38,2.92 SW_MODE.P$2 v11.56,9.27 11.56,12.57 11.43,12.45 10.54,12.45 U5.5 7.87,12.45 7.49,12.83 v7.49,18.67 | C1.2 18.43,33.02 18.16,33.02 v18.29,37.47 | U6.4 39.5,18.34 39.5,17.14 39.24,17.14 38.73,16.64 38.73,16.38 | v47.62,17.14 45.26,17.14 U6.5 | R13.1 34.84,5.21 33.4,5.21 | 38.73,16.38 38.73,14.99 39.12,13.34 39.24,13.21 U7.3 | 20.84,48.64 20.95,48.65 24.89,48.64 25.27,41.15 26.4,40.85 26.54,40.71 v26.54,40.13 | C23.2 37.72,33.15 37.72,27.3 37.72,25.02 | 21.22,24.5 19.18,24.5 17.57,24.73 v15.88,25.02 | v15.88,22.48 16.83,20.98 17.01,20.7 | 29.08,33.15 34.93,33.15 40.51,38.73 40.51,41.78 38.23,44.07 31.88,44.07 30.35,45.59 27.56,45.59 27.56,43.68 C8.2 | v39.12,16.76 38.73,16.38 | J1.10 18.79,48.64
  Top 0.61: JP3.MT1 22.99,1.65 | C10.2 11.44,9.27 v11.56,9.27 | C9.2 10.78,12.45 10.54,12.45 | J2.1 47.1,13.21 46.86,13.21 U7.6 46.99,13.21 arc-90 47.12,13.08 47.37,13.08 arc-90 v47.62,12.83 | v47.62,17.14 39.5,17.14 | C24.2 17.01,20.7 C25.2 | 44.32,25.02 37.72,25.02
  Top 0.813: JP3.MT2 47.12,1.65 | 47.12,1.65 47.12,6.62 J2.1 | 44.32,24.77 44.32,25.02 44.58,25.02 | 49.4,25.02 49.53,24.89 C12.2 | C11.2 44.32,23.37 44.32,24.77 | 44.32,24.77 44.58,25.02 | 44.58,25.02 49.4,25.02 | 49.4,25.02 49.39,24.88 48.9,17.4 48.64,17.14 v47.62,17.14 | J2.NC2 J2.NC1 47.35,1.42 47.12,1.65
  Bottom 0.254: 6.73,6.22 7.5,6.99 U2.15 7.49,6.73 8.26,6.73 8.5,6.97 U2.17 U2.18 9,7.98 9.02,8 | 5.76,6.22 U2.11 | U2.9 6.73,5.21 8,5.21 9.02,4.19 9.02,3.48 U2.1 | v11.56,9.27 10.67,8.38 | JP2.7 3.68,3.17 | 2.16,3.17 2.02,3.31 C5.2 | SJ4.1 46.72,29.59 45.72,29.59 45.21,31.5 43.82,31.5 | U8.2 43.82,31.5 | 43.82,31.5 41.53,31.5 41.53,31.12 39.75,31.12 39.36,30.72 C15.2 39.62,29.71 SW_PWR.P$2 | U3.3 45.21,28.32 45.21,28.57 49.4,28.57 v49.4,25.78
  Bottom 0.305: 5.76,6.22 6.73,6.22 6.73,5.21 | C7.2 11.3,7.75 10.67,8.38 | 3.68,3.17 2.16,3.17 1.14,4.19 1.14,9.78 1.4,10.03 4.19,10.03
  Bottom 0.406: 4.19,10.03 4.19,11.05 7.24,11.05 7.24,8.51 9.02,8.51 | 9.02,8.51 10.79,8.51 v11.56,9.27 | 9.02,8 9.02,8.51 | v7.49,18.67 7.49,21.79 JTAG1.9 | R4.1 5.29,35.12 U1.GND3 9.27,36.23 9.27,37.97 9.41,38.11 U1.6 | U1.6 10.68,37.97 9.53,37.97 6.66,40.33 U1.GND1 | U1.6 18.29,38.11 | 18.29,38.11 21.86,38.11 21.97,38.23 | 21.72,38.48 21.97,38.23 | 21.97,38.23 22.73,37.47 22.99,35.94 23.24,35.69 26.32,35.69 U9.13 26.58,40.1 v26.54,40.13 | v15.88,25.02 v15.88,22.48 | v18.29,37.47 18.29,38.11 | SJ6.1 33.15,16.89 v39.12,16.76
  Bottom 0.61: JTAG1.3 JTAG1.5 JTAG1.7 JTAG1.9 | C5.2 C6.2 1.28,10.03 1.4,10.03 C4.2 | v47.62,12.83 v47.62,17.14
  pour Bottom: 0.38,50.67 50.55,50.67 50.55,0.38 0.38,0.38 0.38,1.4 0.38,22.1 0.38,50.42
I2C_SCL  (via drill 0.6)  (1 unrouted)
  Top 0.254: IC1.20 25.82,14.89 24,12.06 22.22,11.94 18.92,12.19 15.24,12.19 v15.11,12.32 13.84,12.83 13.59,13.08 13.59,14.35 13.46,14.35 13.46,15.49 13.59,15.62 13.08,16.13 9.78,16.13 9.53,16.38
  Top 0.406: R6.1 21.07,11.81 22.22,11.94
  Bottom 0.254: JP2.3 15.37,2.16 12.83,4.7 12.3,4.7 U2.23 13.58,4.71 13.59,4.7 13.59,11.3 v15.11,12.32
I2C_SDA  (via drill 0.6)  (1 unrouted)
  Top 0.254: IC1.21 26.32,14.63 24.26,10.79 18.92,10.79 13.84,10.79 13.49,12.01 | 13.49,12.01 13.08,12.83 13.08,14.1 12.07,15.11 11.94,14.99 U5.7 | v12.57,11.56 13.03,12.01 13.49,12.01 | v12.57,5.71 12.57,1.91 JP2.4
  Top 0.406: R5.1 18.92,10.79
  Bottom 0.254: U2.24 12.31,1.65 | v12.57,5.71 v12.57,11.56
MCU_RX  (via drill 0.61)
  Top 0.254: IC1.61 25.82,33.44 29.84,37.47 v32.89,38.99
  Bottom 0.305: U9.1 44.58,37.47 44.07,37.97 43.82,37.97 42.8,38.99 v32.89,38.99
MCU_TX  (via drill 0.61)
  Top 0.254: IC1.62 25.32,33.57 25.53,33.78
  Top 0.305: v29.21,37.97 28.7,36.96 25.53,33.78
  Bottom 0.305: U9.2 43.08,37.19 42.29,37.97 v29.21,37.97
MPU_INT  (via drill 0.6)
  Top 0.254: JP2.8 2.67,6.73 3.68,7.75 4.32,7.75 4.95,7.11 | IC1.16 19.3,16.94 19.3,15.37 16.13,15.37 v16.13,13.08 | v14.48,4.57 13.84,5.08 13.84,5.97 12.7,7.11 11.3,7.11 10.29,6.1 5.97,6.1 4.95,7.11 | 4.95,7.11 v4.95,7.75
  Bottom 0.254: v14.48,4.57 14.35,10.41 15.49,11.56 16.13,11.56 v16.13,13.08 | v4.95,7.75 5.75,6.95 U2.12
MPU_XCL
  Bottom 0.254: JP2.6 6.48,1.65 6.48,2.16 5.21,3.43 5.21,4.19 5.73,4.19 U2.7
MPU_XDA
  Bottom 0.254: JP2.5 9.27,2.67 8.97,2.69 6.68,2.69 6.58,2.92 6.48,2.92 6.5,2.9 U2.6
N$1
  Bottom 0.254: U8.1 41.45,32.38 SW_PWR.P$4
N$3  (via drill 0.6)
  Top 0.254: v42.04,14.48 U7.2
  Bottom 0.254: SJ6.2 30.48,16.13 30.99,15.62 38.73,15.62 39.12,15.24 39.12,14.48 v42.04,14.48
N$5
  Bottom 0.305: C6.1 4.19,5.97 4.44,5.71 U2.10
N$7
  Bottom 0.305: U2.20 10.92,6.21 C7.1
N$8
  Top 0.406: R7.1 48.89,14.49 LED2.A
N$9  (via drill 0.61)
  Top 0.254: SJ2.1 v34.16,45.85
  Bottom 0.254: v34.16,45.85 32.58,47.43 U9.26
N$11  (via drill 0.61)
  Top 0.254: v44.58,45.85 SJ1.1
  Bottom 0.254: U9.34 v44.58,45.85
N$13
  Top 0.406: C13.1 45.28,19.76 U6.7
N$14
  Top 0.406: U6.6 45.28,19.1 C13.2
N$15  (via drill 0.61)
  Top 0.254: 32.89,41.22 32.89,42.63 | 32.89,41.22 32.96,41.15 34.54,41.15 35.26,40.43 T2.3 | SJ3.2 32.89,41.22
  Top 0.406: 31.59,42.63 32.13,42.63 | 32.13,42.63 32.89,42.63 | 27.44,38.48 v27.81,38.61 C8.1 32.13,42.63
  Bottom 0.406: v27.81,38.61 28.32,36.45 arc-125 U9.12
N$16
  Top 0.254: R10.2 36.08,10.91 35.94,11.81 35.43,12.32 34.42,12.32 34.16,12.57 34.16,15.11 35.18,15.62 T1.3
N$19
  Top 0.305: JP3.D+ 30.61,6.08 R12.2
N$20
  Top 0.305: JP3.D- 29.96,5.97 R11.2
N$23
  Top 0.254: IC1.8 13.85,24 12.83,24.51 12.83,27.8 Y1.P$2 | 13.43,29.57 C1.1
  Top 0.406: Y1.P$2 13.43,29.57
N$24
  Top 0.254: IC1.9 13.08,23.5 12.32,22.73 | 12.32,22.48 12.57,22.23 Y1.P$1 15.72,20.97
  Top 0.305: 15.72,20.97 C2.1
  Top 0.406: 12.32,22.48 12.32,22.73
PO_DISABLE  (via drill 0.6)
  Top 0.254: IC1.45 34.58,26 34.93,25.65 36.32,25.4 36.32,24.13 v38.1,24 | v44.96,27.43 44.96,29.46 45.97,30.48 48.5,30.48 R2.1
  Bottom 0.254: v38.1,24 38.23,25.02 44.2,25.02 U3.2 44.2,28.19 v44.96,27.43
RST  (via drill 0.6, 0.61)
  Top 0.254: v11.05,34.16 8.71,34.16 8.48,33.67 | IC1.4 20.99,26 19.18,27.94 v19.18,34.29
  Top 0.406: U5.4 3.89,12.32 1.14,12.32 1.14,19.68 v2.16,20.7 7.24,26.04 8,26.04 8.48,33.67
  Bottom 0.254: v11.05,34.16 11.3,34.42 19.43,34.42 v19.18,34.29
  Bottom 0.406: v2.16,20.7 3.1,21.64 JTAG1.10 2.92,22.3 2.92,21.72 2.16,20.96 v2.16,20.7
SD_CS  (via drill 0.6)
  Top 0.254: IC1.3 21.25,26.5 19.81,27.94 19.81,33.15 20.45,33.15 20.19,34.16 19.43,35.56 19.3,37.59 19.56,37.85 v19.43,42.42
  Bottom 0.254: U1.2 19.52,42.51 v19.43,42.42
SPI0_MISO  (via drill 0.61)
  Top 0.254: v28.83,20.7 24.77,24.77 24.77,26.29 23.62,26.16 23.24,28.07 21.59,29.59 21.59,34.16 v21.34,34.92 21.08,35.56 20.83,46.35 20.32,46.48 19.05,46.48 19.05,46.86 15.49,46.86 15.11,47.5 14.99,47.62 J1.6 | v31.88,20.7 32.64,21.46 33.73,21.46 IC1.36
  Bottom 0.254: U1.7 18.36,36.38 v21.34,34.92 | v28.83,20.7 v31.88,20.7
SPI0_MOSI  (via drill 0.6, 0.61)
  Top 0.254: v16.64,30.23 17.14,38.73 17.53,39.24 17.53,41.27 | v31.62,21.97 33.74,21.97 IC1.37 | J1.9 17.53,41.27 | v17.02,41.27 17.53,41.27 | v5.46,31.5 5.46,29.84 4.57,28.96 4.57,28.32 3.05,26.8 2.79,26.8 v1.14,24.77
  Bottom 0.254: v31.62,21.97 31.11,22.48 27.81,22.48 26.8,23.5 25.78,23.5 21.21,26.42 19.18,28.45 19.18,28.57 17.53,30.23 v16.64,30.23 12.83,30.23 11.18,28.57 8.38,28.57 v5.46,31.5 | U1.3 11.68,41.41 12.19,41.27 v17.02,41.27 | v1.14,24.77 2.03,24.77 2.29,25.02 JTAG1.6
SPI0_SCK  (via drill 0.61)
  Top 0.254: v13.21,39.24 10.79,39.24 10.54,38.99 v10.54,47.24 10.56,46.85 14.99,46.85 J1.5 | v23.24,38.73 23.24,38.48 22.1,38.61 22.35,34.16 22.22,33.91 22.35,33.15 22.22,30.99 23.62,28.32 26.8,25.27 27.05,25.27 v28.83,23.5 | v31.62,23.5 31.62,23.24 32.39,22.48 33.75,22.48 IC1.38
  Bottom 0.254: R4.2 2.92,34.55 2.92,39.24 4.44,40.77 4.44,49.4 10.54,49.4 v10.54,47.24 | U1.5 13.3,39.21 v13.21,39.24 19.94,39.24 20.95,40.26 22.73,40.26 22.73,39.24 v23.24,38.73 | v28.83,23.5 v31.62,23.5
  Bottom 0.406: JTAG1.4 0.89,26.29 0.89,33.66 R4.2
SW_MODE
  Top 0.254: SW_MODE.P$3 25.53,9.53 27.3,11.3 27.3,18.04 IC1.23
SW_PWR_STATE  (via drill 0.6)
  Top 0.254: v42.16,27.94 41.4,28.7 v38.73,28.83 | v35.43,24.51 35.45,25 IC1.43
  Bottom 0.254: U8.5 43.31,29.21 U3.1 42.95,28.73 v42.16,27.94 | v38.73,28.83 35.56,25.53 v35.43,24.51
SWDIO  (via drill 0.61)
  Top 0.254: v30.35,31.62 30.35,29.48 IC1.52
  Bottom 0.254: 2.41,32.51 4.06,32.64 30.35,32.77 v30.35,31.62
  Bottom 0.406: R3.1 2.67,31.23 2.67,31.12 | 3.43,27.56 JTAG1.2 2.67,27.56 2.67,31.12 | 2.67,31.12 2.41,31.12 2.41,32.51
SYS_SHUTDOWN
  Bottom 0.254: U8.3 44.73,32 45.72,32 45.97,31.24 45.97,30.77 SJ4.2
USB_SCON
  Top 0.254: IC1.29 30.32,16.38 30.35,16.38 30.35,15.37 33.3,15.37 T1.1
USBD_N
  Top 0.254: IC1.25 28.32,12.51 30.1,10.79 30.1,10.4 C16.2
  Top 0.61: R11.1 29.34,9.64 C16.2
USBD_P
  Top 0.254: IC1.26 28.82,12.65 30.68,10.79 | 30.68,10.79 30.77,10.7 30.77,10.24 C17.2 | R10.1 30.68,10.79
  Top 0.61: R12.1 31.11,9.66 C17.2
VBAT  (via drill 0.6, 0.61)
  Top 0.254: 4.19,43.3 4.19,35.69 6.73,33.15 v6.73,31.62 | v14.35,14.86 14.35,17.4 v14.1,17.65 10.79,17.65 v10.79,29.97 | v38.11,17.86 38.06,17.81 38.06,17.39
  Top 0.305: C9.1 10.79,13.84 v12.07,13.84 | C14.2 45.1,9.27 | J1.4 13.72,50.55 4.19,50.55 4.19,43.3
  Top 0.406: 37.97,17.02 38.23,19.1 U6.3 39.6,19.18 | 39.6,19.18 38.23,19.05 v38.11,17.86 38.06,17.39 37.97,17.02 | 37.97,17.02 v38.1,13.84 38.23,9.27 38.73,9.27 | 38.73,9.27 45.1,9.27 | R1.2 38.73,9.27 | 39.6,19.18 v41.28,19.18 | v41.02,21.72 41.4,22.09 C11.1
  Top 0.61: C9.1 10.28,13.72 U5.6
  Top 0.813: J2.2 45.1,9.27 45.1,11.94 U7.5
  Bottom 0.254: v6.73,31.62 7.49,30.86 10.29,30.48 v10.79,29.97 | v14.35,14.86 14.86,14.35 14.86,13.84 | C15.1 42.02,28.98 | 42.02,28.98 U8.6 | 42.02,28.98 41.02,27.98 41.02,26.54 | 41.02,26.54 41.02,26.29 36.7,26.04 36.7,18.92 | 36.7,18.92 37.76,17.86 v38.11,17.86 | U3.5 41.02,26.54 | SJ6.3 29.59,18.16 35.94,18.16 36.7,18.92
  Bottom 0.305: v12.07,13.84 14.86,13.84 15.37,13.84 15.37,14.1 17.27,14.1 17.27,13.84 17.4,13.84 17.4,13.97
  Bottom 0.406: v38.1,13.84 17.4,13.84 17.65,6.99 20.45,4.19 JP2.1 | v41.28,19.18 41.02,19.43 v41.02,21.72
VBATMON  (via drill 0.61)
  Top 0.254: v39.75,23.11 38.86,22.99 37.47,22.99 37.47,23.5 IC1.40
  Top 0.406: R13.2 36.96,4.79 v36.96,12.57
  Top 0.61: R13.2 38.73,4.7 R1.1
  Bottom 0.406: v36.96,12.57 43.18,12.57 43.05,22.99 v39.75,23.11
VUSB  (via drill 0.6, 0.61)
  Top 0.254: 25.27,17.54 IC1.19 25.27,17.5 25.27,15.11 23.24,13.08 v23.49,12.83
  Top 0.406: U7.4 40.34,11.81 43.82,11.81 43.69,14.48 | 43.69,14.48 U7.7 45.39,14.61 R7.2 | 43.69,14.48 43.69,15.75 U7.1 | v28.32,5.46 28.32,5.29 JP3.VBUS
  Top 0.813: 40.34,11.81 40.34,11.3 v39.75,10.79
  Bottom 0.406: 29.08,6.22 28.07,6.22 26.04,8.25 26.04,11.56 24.77,12.83 v23.49,12.83 23.75,12.83
  Bottom 0.813: v39.75,10.79 39.75,6.22 29.08,6.22 v28.32,5.46

### Text on the board
_tsilk: SwiMate V1.0 / CSE 477 Spring 2014 / P. Bartell, J. Ellington, / Z. Zhu, A. Briggs.